# EAGLE design b (EAGLE 9.6.2)
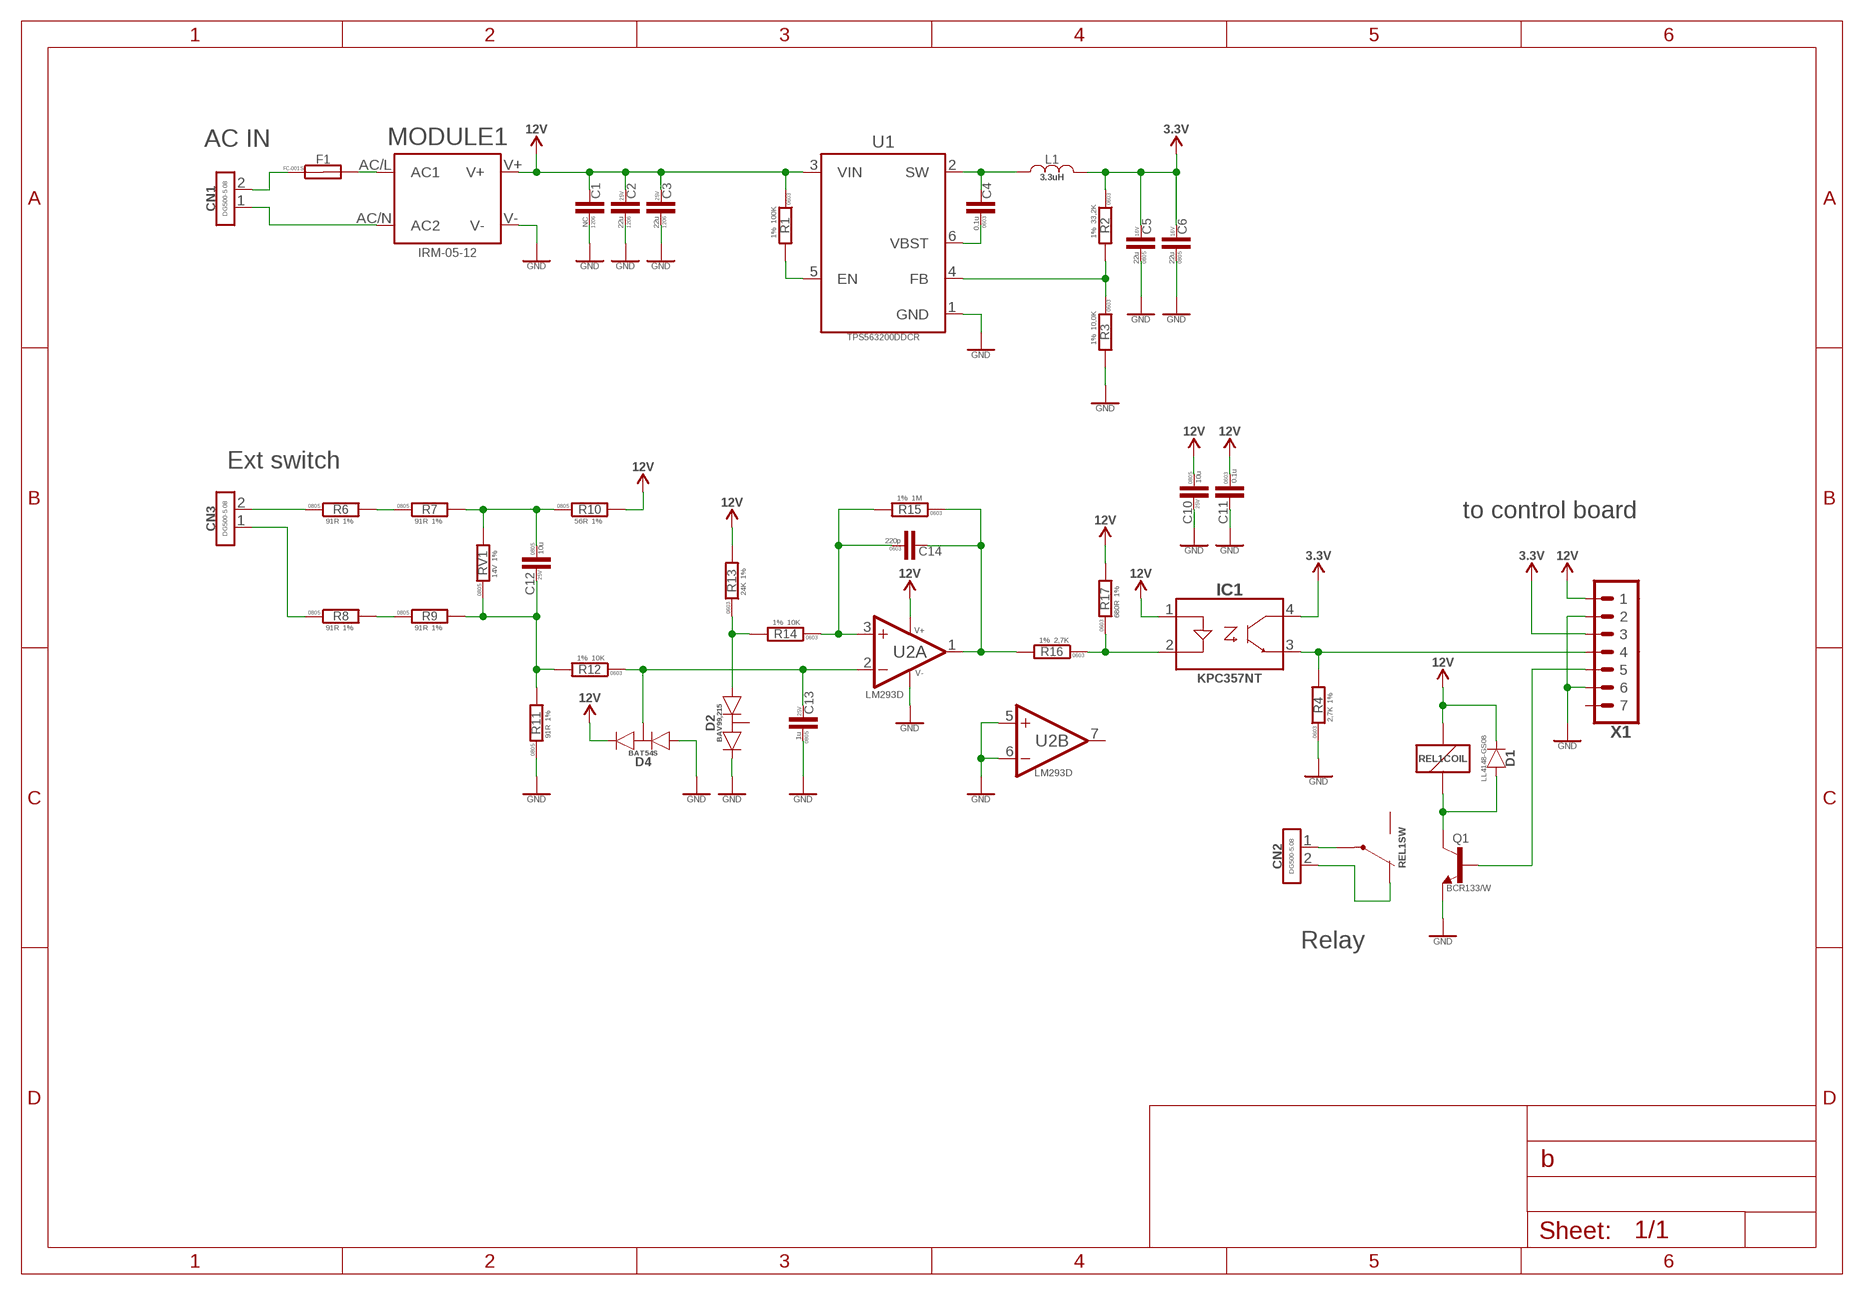
[diagram p0: schematic, sheet 1]

## Parts
C1  NC  C-1206  [C1206]
C2  22u  C-1206  [C1206]
C3  22u  C-1206  [C1206]
C4  0.1u  C-0603  [C0603]
C5  22u  C-0805  [C0805]
C6  22u  C-0805  [C0805]
C10  10u  C-0805  [C0805]
C11  0.1u  C-0603  [C0603]
C12  10u  C-0805  [C0805]
C13  1u  C-0805  [C0805]
C14  220p  C-0603  [C0603]
CN1  DG508V-2P  CON-2P-DG500-5.08  [DG500-5.08-02P]
CN2  CON-2P-DG500-5.08  [DG500-5.08-02P]
CN3  DG508V-2P  CON-2P-DG500-5.08  [DG500-5.08-02P]
D1  LL4148  [LL-34]
D2  BAV99-SOT23  [SOT23]
D4  BAT54S-SOT23  [SOT23]
F1  2A  FUSE-FC-001S  [FC-001S]
IC1  KPC357NT-SOP-4  [-SOP-4]
L1  3.3uH  3.3µH-0520  [LSMD_05020]
MODULE1  IRM-05-12  [IRM-05]
Q1  BCR133  [SOT23B-3]
R1  100K  R-1%-0603  [R0603]
R2  33,2K  R-1%-0603  [R0603]
R3  10,0K  R-1%-0603  [R0603]
R4  2,7K  R-1%-0603  [R0603]
R6  91R  R-1%-0805  [R0805]
R7  91R  R-1%-0805  [R0805]
R8  91R  R-1%-0805  [R0805]
R9  91R  R-1%-0805  [R0805]
R10  56R  R-1%-0805  [R0805]
R11  91R  R-1%-0805  [R0805]
R12  10K  R-1%-0603  [R0603]
R13  24K  R-1%-0603  [R0603]
R14  10K  R-1%-0603  [R0603]
R15  1M  R-1%-0603  [R0603]
R16  2,7K  R-1%-0603  [R0603]
R17  680R  R-1%-0603  [R0603]
REL1  RELAY_SPDTHJR-3FF-SH  [HJR-3FF-12VDC-S-Z]
RV1  14V  R-1%-0805  [R0805]
U1  TPS563200  [SOT23-6]
U2  LM293D  LM293D-SO8  [SOIC8]
X1  PINHEAD_1X07-2.54  [1X07-PTH-2.54]

## Nets
EXT_SW: IC1.3(EMITTER) R4.2 X1.4
GND: C1.P$1 C2.P$1 C3.P$1 C5.1 C6.1 C10.2 C11.2 C13.1 D2.2(C) D4.1(A) MODULE1.V- Q1.2(E) R3.2 R4.1 R11.1 U1.1(GND) U2.4(P:V-) U2.5(B:IN+) U2.6(B:IN-) X1.2 X1.6
N$1: D1.A Q1.3(C) REL1.2
N$2: Q1.1(B) X1.5
N$3: CN2.1 REL1.1(SW:COM)
N$4: CN1.1 MODULE1.AC/N(AC2)
N$5: CN1.2 F1.1-1 F1.1-2
N$6: F1.2-1 F1.2-2 MODULE1.AC/L(AC1)
N$7: CN2.2 REL1.4(SW:NC)
N$8: R2.2 R3.1 U1.4(FB)
N$10: CN3.2 R6.1
N$11: CN3.1 R8.1
N$12: R1.2 U1.5(EN)
N$13: C4.1 U1.6(VBST)
N$15: C4.2 L1.1 U1.2(SW)
N$23: IC1.2(C) R16.1 R17.1
N$31: C14.2 R15.1 R16.2 U2.1(A:OUT)
N$40: C13.2 D4.3(COMMON) R12.1 U2.2(A:IN-)
N$57 [24V]: C12.1 R7.2 R10.1 RV1.2
N$66 [24V]: R6.2 R7.1
N$71 [24V]: R8.2 R9.1
N$73: C14.1 R14.1 R15.2 U2.3(A:IN+)
N$74: D2.1(A) R13.1 R14.2
N$76: C12.2 R9.2 R11.2 R12.2 RV1.1
VDD_3V3: C5.2 C6.2 IC1.4(COLLECTOR) L1.2 R2.1 X1.3 ; supply symbol labelled 3.3V
VDD_12V: C1.P$2 C2.P$2 C3.P$2 C10.1 C11.1 D1.C D4.2(C) IC1.1(A) MODULE1.V+ R1.1 R10.2 R13.2 R17.2 REL1.5 U1.3(VIN) U2.8(P:V+) X1.1 ; supply symbol labelled 12V
Unconnected: D2.3(COMMON) REL1.3(SW:NO) U2.7(B:OUT) X1.7

## Notes on the sheet
- AC IN
- Ext switch
- to control board
- Relay

## Library data of the parts
C1 = rc:C; PACKAGE: 1206
C2 C3 = rc:C; PACKAGE: 1206; VOLTAGE: 25V
C4 C11 C14 = rc:C; PACKAGE: 0603
C5 C6 = rc:C; PACKAGE: 0805; VOLTAGE: 16V
C10 C12 C13 = rc:C; PACKAGE: 0805; VOLTAGE: 25V
CN1-CN3 = degson:CON-2P; MANF: Degson Electronics; MANF#: DG-500-5.08-02P-14; TYPE: DG500-5.08
D1 = Diodes:LL4148: Small Signal Diode; MANF: VISHAY INTERTECHNOLOGY INC; MANF#: LL4148-GS08
D2 = Diodes:BAV99: Planar Schottky barrier diodes; MANF: NEXPERIA; MANF#: BAV99,215
D4 = Diodes:BAT54S: Planar Schottky barrier diodes; MANF: NEXPERIA; MANF#: BAT54S
F1 = rc:FUSE; PACKAGE: FC-001S
IC1 = misc:KPC357NT: 4PIN MINI-FLAT PHOTOTRANSISTOR PHOTOCOUPLER; MANF: COSMO; MANF#: KPC357NT
L1 = power_inductors:3.3µH; MANF: Chilisin; MANF#: MHCI05030-3R3M-R8LM
MODULE1 = ac-dc:IRM-05-12: 5W AC-DC High Reliable PCB-Mount Green Industrial Power Module; MANF: Meanwell; MANF#: IRM-05-12
Q1 = misc:BCR133: NPN Silicon Digital Transistor; MANF: INFINEON TECHNOLOGIES AG.; MANF#: BCR133/W
R1-R4 R12-R17 = rc:R; PACKAGE: 0603; TOLERANCE: 1%
R6-R11 RV1 = rc:R; PACKAGE: 0805; TOLERANCE: 1%
REL1 = misc:RELAY_SPDT; MANF: Tianbo; MANF#: HJR-3FF-12VDC-S-Z
U1 = dc-dc:TPS563200: TPS56x200 4.5-V To 17-V Input, 2-A, 3-A Synchronous Step-Down Voltage Regulator In6 Pin SOT-23 datasheet <https://static.chipdip.ru/lib/786/DOC059786447.pdf>; MANF: Texas Instruments; MANF#: TPS563200DDCR
U2 = misc:LM293D: Low-power, dual-voltage comparators; MANF: STMicroelectronics; MANF#: LM293D
X1 = pinhead:PINHEAD_1X07: pinheader 7P

## Net classes
0 default: width 0.254 mm, clearance 0.254 mm
1 24V: clearance 0.305 mm
2 12v: width 0.254 mm, drill 0.508 mm, clearance 0.254 mm
12 Vbat: width 0.229 mm, clearance 0.305 mm

## Board
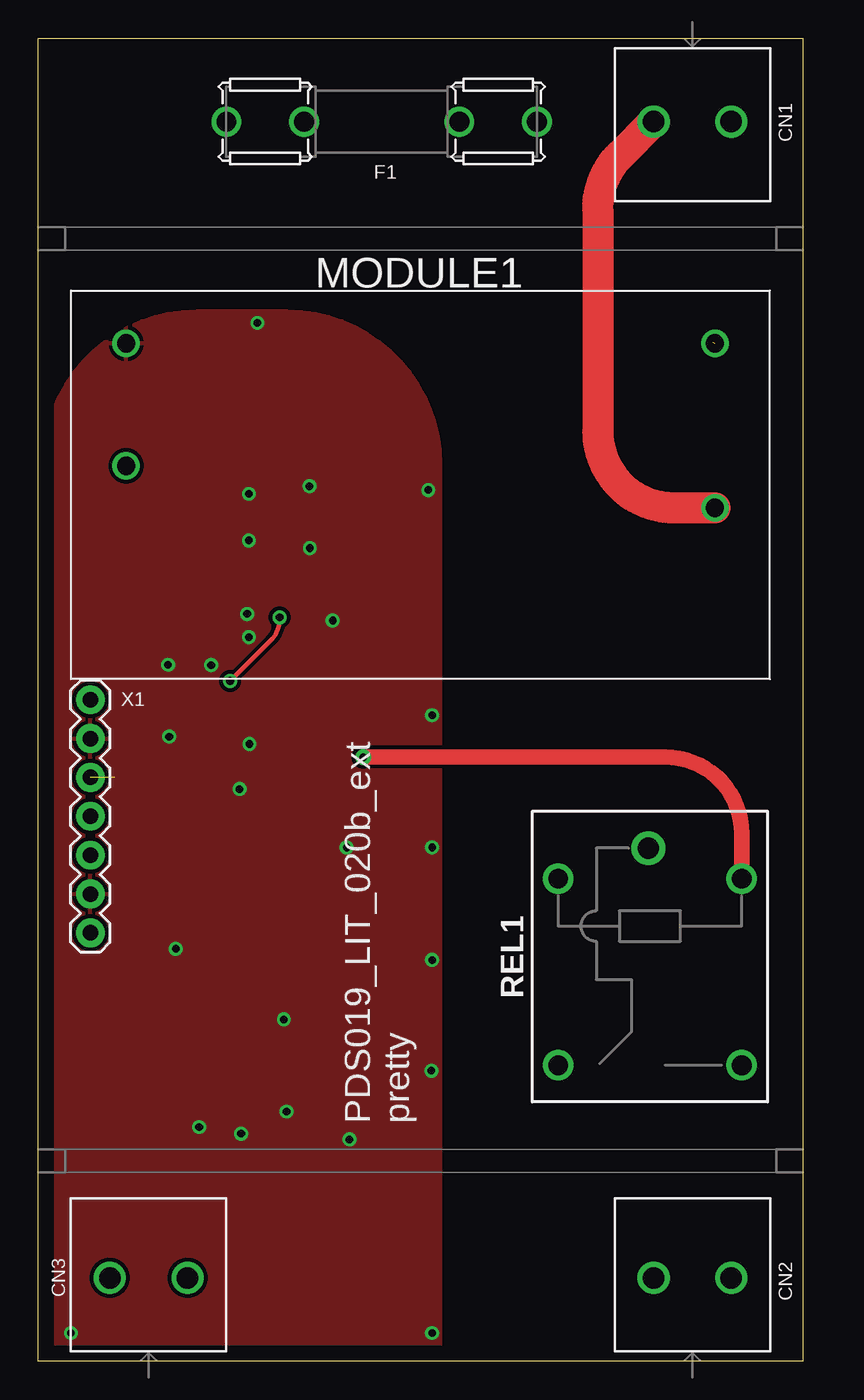
[diagram p1: board, top side]
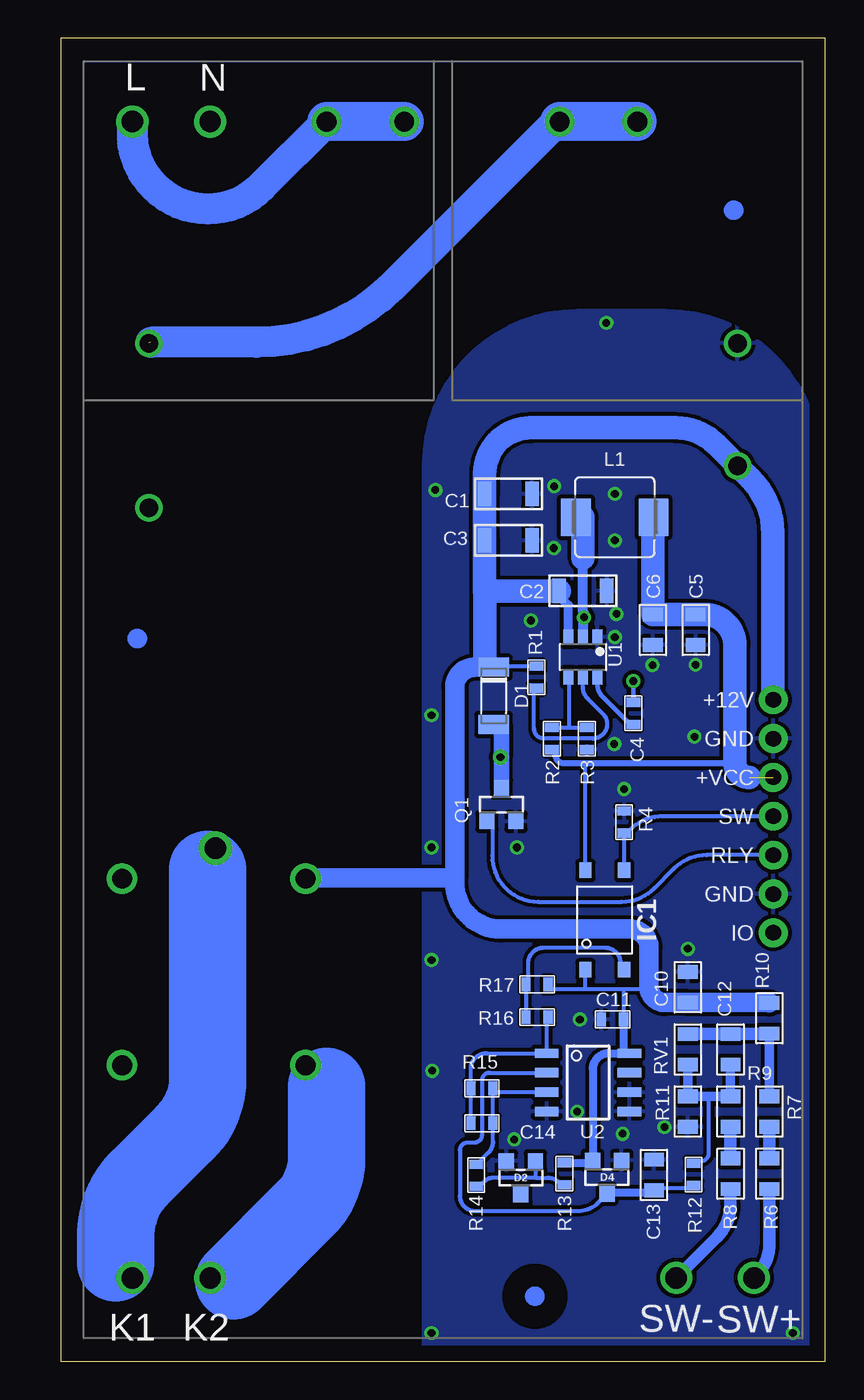
[diagram p2: board, bottom side, seen from below]

Size 50 x 86.5 mm. Coordinates in mm from the lower left corner, seen from the top.
Outline: 0,86.5 50,86.5 50,0 0,0 0,86.5
Copper layers (1*16): Top 0.035mm / dielectric 1.5mm / Bottom 0.035mm
Design rules "pds019_lit *": minimum track width 8mil, minimum drill 0.5mm, track to track 8mil, track to pad 8mil, pad to pad 8mil, via to via 8mil, smd to smd 0mil, copper to edge 40mil, drill to drill 8mil, minimum pad ring 10mil, minimum via ring 8mil, stop-mask expansion 4mil, vias tented up to drill 2mm, thermal gap 10mil

### Footprints (pad centres in the part's own frame; a part is rotated, then mirrored left to right if it is on the bottom)
C1206 = smd 0.9 x 1.6: P$1 -1.55,0; P$2 1.55,0
C0603 = smd 0.6 x 0.9: 1 -0.725,0; 2 0.725,0
C0805 = smd 0.9 x 1.3: 1 -1,0; 2 1,0
DG500-5.08-02P = drill 1.4: 1 -2.54,0; 2 2.54,0
LL-34 = smd 1.25 x 2: A -1.875,0; C 1.875,0
SOT23 = smd 1 x 1: 1 1.1,-0.95; 2 1.1,0.95; 3 -1.1,0
FC-001S = drill 1.295: 1-1 -10.16,0; 1-2 -5.08,0; 2-1 10.16,0; 2-2 5.08,0
-SOP-4 = smd 1 x 0.8: 1 -3.25,1.27; 2 -3.25,-1.27; 3 3.25,-1.27; 4 3.25,1.27
LSMD_05020 = smd 1.981 x 2.489: 1 -2.54,0; 2 2.54,0
IRM-05 = drill 1.2: AC/L 19.25,9.25; AC/N 19.25,-1.5; V+ -19.25,1.25; V- -19.25,9.25
SOT23B-3 = smd 1 x 1: 1 -0.95,-1.1; 2 0.95,-1.1; 3 0,1.1
R0603 = smd 0.6 x 0.9: 1 -0.725,0; 2 0.725,0
R0805 = smd 0.9 x 1.3: 1 -1,0; 2 1,0
HJR-3FF-12VDC-S-Z = drill 1.4 pad 2.2: 1 7.1,0.1 | drill 1.3 pad 2: 2 5.1,-6; 3 -7.1,-6; 4 -7.1,6; 5 5.1,6
SOT23-6 = smd 1 x 0.65: 1 1.3,-0.95; 2 1.3,0; 3 1.3,0.95; 4 -1.3,0.95; 5 -1.3,0; 6 -1.3,-0.95
SOIC8 = smd 0.6 x 1.55: 1 -1.905,-2.7; 2 -0.635,-2.7; 3 0.635,-2.7; 4 1.905,-2.7; 5 1.905,2.7; 6 0.635,2.7; 7 -0.635,2.7; 8 -1.905,2.7
1X07-PTH-2.54 = drill 1.016 pad 1.88: 1 -7.62,0; 2 -5.08,0; 3 -2.54,0; 4 0,0; 5 2.54,0; 6 5.08,0; 7 7.62,0

### Placement (x,y rotation side)
C1  20.73,56.71 180 bottom
C2  15.86,50.36 180 bottom
C3  20.73,53.66 180 bottom
C4  12.55,42.36 90 bottom
C5  8.49,47.82 90 bottom
C6  11.28,47.82 90 bottom
C10  9,24.45 90 bottom
C11  13.93,22.35 180 bottom
C12  6.2,20.39 270 bottom
C13  11.21,12.18 270 bottom
C14  22.46,15.56 180 bottom
CN1  42.78,81.05 0 top
CN2  42.78,5.45 180 top
CN3  7.22,5.45 180 top
D1  21.7,43.5 90 bottom
D2  19.92,12.01 90 bottom
D4  14.28,12.03 90 bottom
F1  22.46,81.05 180 top
IC1  14.43,28.85 90 bottom
L1  13.77,55.19 0 bottom
MODULE1  25,57.3 0 top
PCB_B  [D3MG_PCB]  25,43.25 0 top
Q1  21.19,36.39 0 bottom
R1  18.9,44.72 270 bottom
R2  17.89,40.71 90 bottom
R3  15.6,40.71 270 bottom
R4  13.16,35.25 270 bottom
R6  3.66,12.26 90 bottom
R7  3.66,16.33 90 bottom
R8  6.2,12.26 90 bottom
R9  6.2,16.33 90 bottom
R10  3.66,22.42 90 bottom
R11  9,16.33 90 bottom
R12  8.62,12.21 90 bottom
R13  17.08,12.26 90 bottom
R14  22.84,12.16 270 bottom
R15  22.46,17.85 0 bottom
R16  18.85,22.5 0 bottom
R17  18.85,24.63 0 bottom
REL1  40,26.45 90 top
RV1  9,20.39 90 bottom
U1  15.86,46.04 90 bottom
U2  15.53,18.23 270 bottom
U$1  [REF_POINT_D1.27_D3.81]  6,75.25 0 bottom
U$2  [REF_POINT_D1.27_D3.81]  45,47.25 0 bottom
U$3  [REF_POINT_D1.27_D3.81]  19,4.25 0 bottom
X1  3.41,35.63 270 top

### Tracks (layer width: path | path; a pad name or v marks a point on that pad's centre or on a via)
EXT_SW
  Bottom 0.254: 13.09,32.02 IC1.3 R4.2 13.01,34.52 12.79,34.75 arc45 10.66,35.63 X1.4
GND  (via drill 0.5)
  other vias: 13.77,56.71 11.31,45.51 8.49,45.54 8.57,40.84 17.76,53.16 17.74,57.21 13.77,47.34 16.24,16.33 10.52,15.31 16.06,22.35 20.35,14.5 9,26.97 13.16,37.41 20.17,33.6 13.27,14.88 14.33,67.89 25.51,56.97 25.76,33.6 25.76,1.85 2.14,1.85 13.77,53.66 25.71,18.99 13.66,48.86 25.76,42.23 25.76,26.23 19.26,48.43 13.81,40.36
  pour Bottom (isolate 0.254): 0.36,0.32 0.36,58.65 arc-90 10.36,68.65 16.27,68.65 arc-90 26.27,58.65 26.27,0.32
  pour Top (isolate 0.254): 0.36,0.32 0.36,58.65 arc-90 10.36,68.65 16.27,68.65 arc-90 26.27,58.65 26.27,0.32
N$1  (via drill 0.5 pad 1)
  Top 1: REL1.2 46,34.5 arc90 41,39.5 v21.25,39.5
  Bottom 1: Q1.3 21.19,39.5 | 21.19,39.5 v21.25,39.5 | D1.A 21.19,41.63 21.19,39.5
N$2
  Bottom 0.254: X1.5 7.78,33.09 arc-45 9.9,32.21 11.19,30.92 arc45 13.31,30.04 18.79,30.04 arc90 21.79,33.04 21.79,35.29 Q1.1
N$3
  Bottom 1: 40.39,32.16 40.39,33.55 REL1.1 | CN2.1 46.32,6.45 46.4,6.45
  Bottom 5.08: 40.39,32.16 40.39,18.5 arc45 41.86,14.96 44.94,11.88 arc-45 46.4,8.35 46.4,6.45
N$4
  Top 2.032: MODULE1.AC/N 41.59,55.8 arc-90 36.59,60.8 36.59,75.33 arc-45 38.05,78.86 CN1.1
N$5
  Bottom 2.032: CN1.2 45.32,80.27 arc-135 36.9,76.78 32.63,81.05 F1.1-1
  Bottom 2.54: F1.1-2 F1.1-1
N$6  (1 unrouted)
  Bottom 2.032: F1.2-2 17.56,81.05 28.3,70.31 arc45 37.2,66.62 44.13,66.62
  Bottom 2.54: F1.2-1 F1.2-2
N$7
  Bottom 1: REL1.4 34,17.97 32.62,17.97 | CN2.2 38.88,5.45 38.7,5.27
  Bottom 2: REL1.4 33.9,19.25 32.8,19.25
  Bottom 5.08: 32.62,17.97 32.62,13.32 arc45 34.01,9.95 38.7,5.27
N$8
  Bottom 0.254: U1.4 16.77,44.71 16.77,41.46 16.75,41.44 | 15.77,41.6 R3.1 16.75,41.44 | R2.2 16.75,41.44
N$10
  Bottom 0.813: R6.1 3.66,7.71 arc45 4.54,5.59 CN3.2
N$11
  Bottom 0.813: R8.1 6.2,10.25 arc45 7.08,8.13 CN3.1
N$12
  Bottom 0.254: U1.5 15.86,44.05 arc-45 15.56,43.34 14.56,42.33 arc135 15.23,40.71 18.4,40.71 arc90 19.05,41.36 19.05,43.85 R1.2
N$13
  Bottom 0.305: U1.6 14.91,44.21 arc-45 14.61,43.5 12.75,41.64 C4.1
N$15  (via drill 0.51)
  Top 0.305: v15.78,48.63 15.78,48.52 arc-45 15.19,47.11 v12.55,44.47
  Bottom 0.305: C4.2 v12.55,44.47
  Bottom 0.61: 15.86,48.56 v15.78,48.63
  Bottom 0.66: 15.86,52.52 15.86,48.99 15.78,48.91 v15.78,48.63 15.86,48.63 U1.2
  Bottom 1.524: 15.86,52.52 15.86,55.19 L1.1
N$23
  Bottom 0.254: IC1.2 13.41,25.85 13.41,26.05 arc-90 14.41,27.05 18.43,27.05 arc-90 19.43,26.05 19.43,24.78 R17.1 R16.1
N$31
  Bottom 0.254: R16.2 18.23,22.4 U2.1 22.18,20.14 arc-90 23.18,19.14 R15.1 C14.2
N$40
  Bottom 0.254: U2.2 21.96,18.87 arc-90 22.46,18.37 22.46,14.79 arc90 22.96,14.29 23.41,14.29 arc-90 23.91,13.79 23.91,10.82 arc-90 22.91,9.82 16.22,9.82 arc-45 14.8,10.41 D4.3 | R12.1 8.77,11.33 11.05,11.33 C13.2 11.3,11.28
  Bottom 0.508: D4.3 14.18,11.03 11.3,11.03 11.3,11.28
N$57
  Bottom 0.61: R7.2 3.66,21.36 3.7,21.39
  Bottom 0.813: R10.1 3.7,21.39 C12.1 RV1.2
N$66
  Bottom 0.813: R6.2 R7.1
N$71
  Bottom 0.813: R8.2 R9.1
N$73
  Bottom 0.254: R14.1 22.79,12.89 22.03,13.65 arc-45 21.73,14.36 C14.1 21.73,17.75 | 21.73,17.75 R15.2 | U2.3 21.58,17.6 21.73,17.75
N$74
  Bottom 0.254: 18.98,12.01 18.16,12.01 arc45 17.45,11.71 17.27,11.54 R13.1 | R14.2 22.64,11.43 22.36,11.71 arc45 21.65,12.01 18.98,12.01 | D2.1 18.98,12.01
N$76
  Bottom 0.254: R12.2 8.45,13.1 8.13,13.1 arc-90 7.63,13.6 7.63,17.3 7.6,17.33
  Bottom 0.61: C12.2 R9.2 7.6,17.33 | 7.63,17.3 7.65,17.33 R11.2 RV1.1
VDD_3V3  (1 unrouted)
  Bottom 0.254: IC1.4 15.7,39.1
  Bottom 0.406: R2.1 17.64,39.98 17.64,39.6 arc-90 17.14,39.1 15.7,39.1 | 15.7,39.1 5.92,39.1 | 15.7,39.1
  Bottom 1.524: 4.99,38.17 arc90 5.92,39.1 5.92,46.82 arc-90 7.92,48.82 C5.2 C6.2 11.28,55.14 L1.2
VDD_12V
  Bottom 0.254: 15.7,24.34 13.21,24.34 | 21.72,46.86 21.7,46.88 | 15.7,24.34 IC1.1 | 13.21,24.34 11.54,24.34 11.54,24.5 | R17.2 18.13,24.53 17.94,24.34 15.7,24.34 | 21.7,45.45 R1.1 | C11.1 13.21,22.35 13.21,24.34
  Bottom 0.3: D1.C 21.7,45.45 | D1.C 22.35,45.38 | D1.C 21.7,46.86 21.72,46.86 | D1.C 21.7,45.51 22.28,45.51
  Bottom 0.508: 13.2,20.14 14.17,20.14 arc-90 15.22,19.09 D4.2 15.23,12.99 R13.2 | C11.1 13.2,20.14 | 13.2,20.14 U2.8
  Bottom 0.6: C2.P$2 17.41,50.01 16.81,49.41 U1.3
  Bottom 1.27: 24.24,31.6 24.24,31.26 arc-90 21.24,28.26 12.79,28.26 arc90 11.54,27.01 11.54,24.5 arc-90 10.49,23.45 C10.1 3.66,23.45 R10.2 | 22.35,45.38 22.94,45.38 arc-90 24.24,44.08 24.24,31.6 | 24.24,31.6 33.95,31.6 REL1.5
  Bottom 1.524: 22.28,45.51 22.28,50.36 | X1.1 3.44,43.28 3.44,54.17 arc-45 4.91,57.71 MODULE1.V+ 7.12,59.92 arc-45 9.8,61.03 19.28,61.03 arc-90 22.28,58.03 C1.P$2 C3.P$2 22.28,50.36 | 22.28,50.36 C2.P$2

### Text on the board
tPlace: PDS019_LIT_020b_ext / pretty
bPlace: N | L | +12V | GND | +VCC | SW | RLY | GND | IO | SW+ | SW- | K2 | K1